# Altium project MotherBoard.PrjPCB
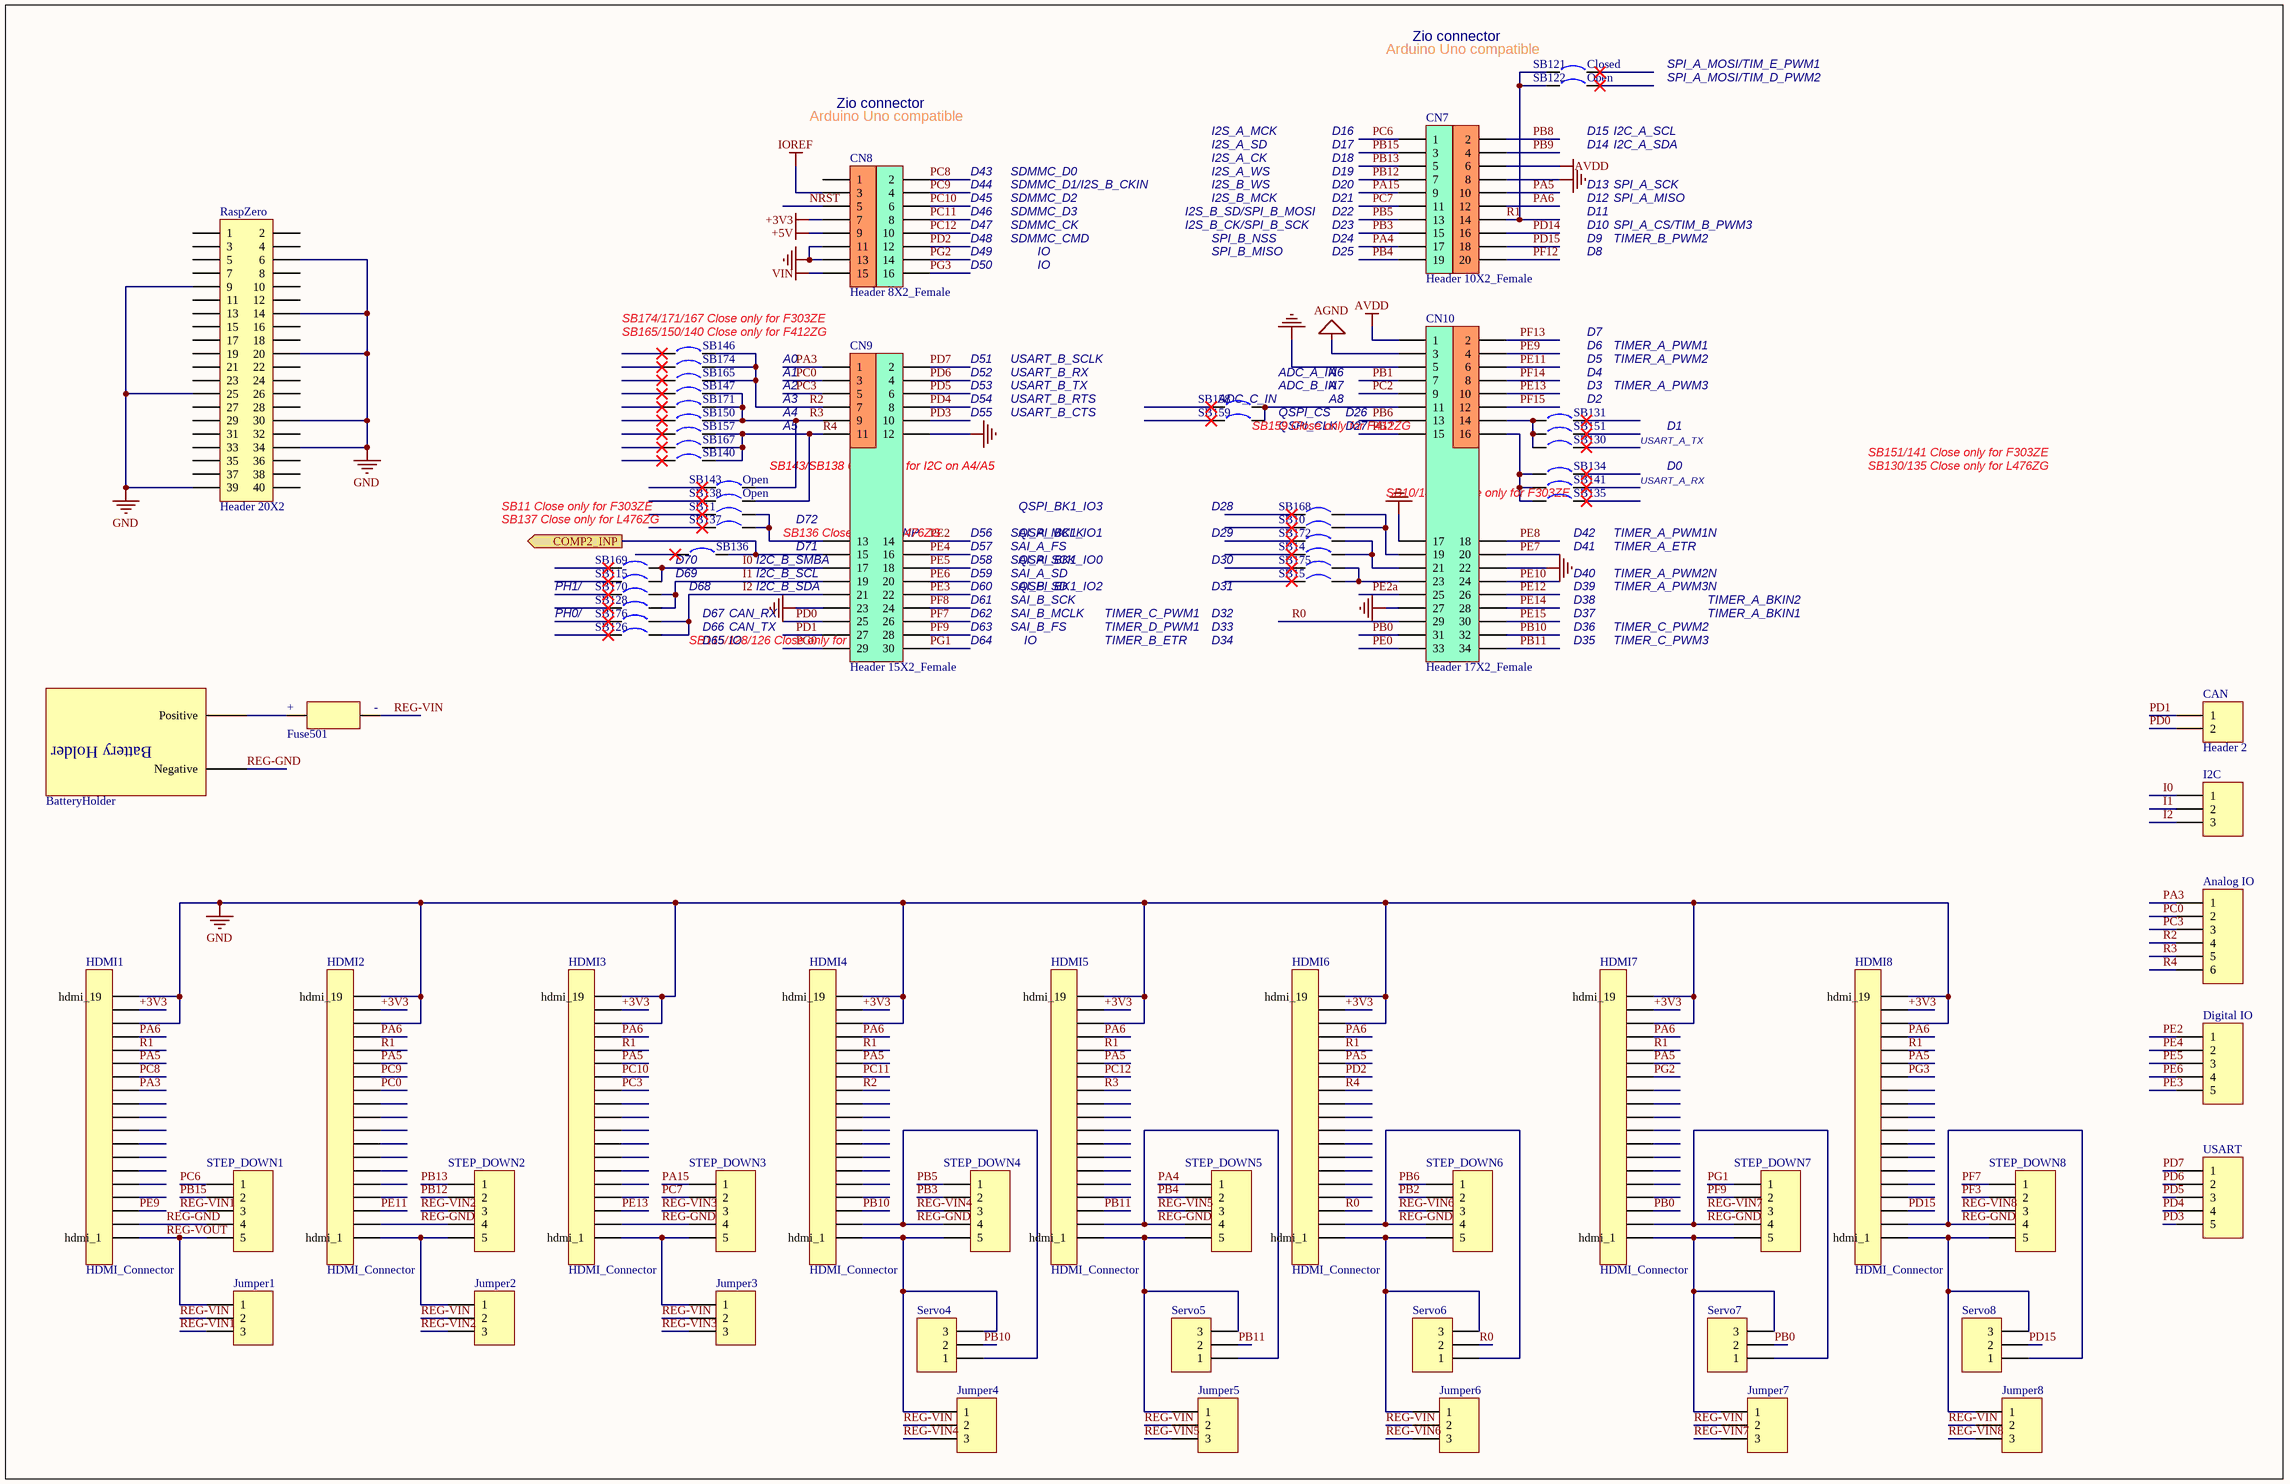
[diagram p0: MB1137.SchDoc]
2 sheets, 77 parts. Net scope: flat (ports and power ports of the same name join across sheets).
Board file: MB1137.PcbDoc
Sheets:
  MB1137.SchDoc
  Connectors.SchDoc

## Sheet MB1137.SchDoc: TOP & POWER
size Tabloid; DocumentNumber: MB1137; Revision: B-01; SheetNumber: 1; SheetTotal: 6; Project: NUCLEO-XXXXZX

### Parts
Analog_IO  Header 6  [HDR1X6]  (value not drawn)
BatteryHolder  BatteryHolder  [SOIC127P370X135-2N]  (value not drawn)
CAN  Header 2  [HDR1X2]
CN7  Header 10X2_Female  [HDR_10x2_2R54_V_F]
CN8  Header 8X2_Female  [HDR_8x2_2R54_V_F]
CN9  Header 15X2_Female  [HDR_15x2_2R54_V_F]
CN10  Header 17X2_Female  [HDR_17x2_2R54_V_F]
Digital_IO  Header 5  [HDR1X5]  (value not drawn)
Fuse501  Fuse501  (value not drawn)
HDMI1  HDMI_Connector  [HDMI-CONNECTOR]
HDMI2  HDMI_Connector  [HDMI-CONNECTOR]
HDMI3  HDMI_Connector  [HDMI-CONNECTOR]
HDMI4  HDMI_Connector  [HDMI-CONNECTOR]
HDMI5  HDMI_Connector  [HDMI-CONNECTOR]
HDMI6  HDMI_Connector  [HDMI-CONNECTOR]
HDMI7  HDMI_Connector  [HDMI-CONNECTOR]
HDMI8  HDMI_Connector  [HDMI-CONNECTOR]
I2C  Header 3  [HDR1X3]  (value not drawn)
Jumper1  Header 3  [HDR1X3]  (value not drawn)
Jumper2  Header 3  [HDR1X3]  (value not drawn)
Jumper3  Header 3  [HDR1X3]  (value not drawn)
Jumper4  Header 3  [HDR1X3]  (value not drawn)
Jumper5  Header 3  [HDR1X3]  (value not drawn)
Jumper6  Header 3  [HDR1X3]  (value not drawn)
Jumper7  Header 3  [HDR1X3]  (value not drawn)
Jumper8  Header 3  [HDR1X3]  (value not drawn)
RaspZero  Header 20X2  [HDR2X20]
SB10  Circuit Breaker  [SB_0603]  (value not drawn)
SB11  Circuit Breaker  [SB_0603]  (value not drawn)
SB14  Circuit Breaker  [SB_0603]  (value not drawn)
SB15  Circuit Breaker  [SB_0603]  (value not drawn)
SB115  Circuit Breaker  [SB_0603]  (value not drawn)
SB121  Closed  [SB_0603]
SB122  Open  [SB_0603]
SB126  Circuit Breaker  [SB_0603]  (value not drawn)
SB128  Circuit Breaker  [SB_0603]  (value not drawn)
SB130  Circuit Breaker  [SB_0603]  (value not drawn)
SB131  Circuit Breaker  [SB_0603]  (value not drawn)
SB134  Circuit Breaker  [SB_0603]  (value not drawn)
SB135  Circuit Breaker  [SB_0603]  (value not drawn)
SB136  Circuit Breaker  [SB_0603]  (value not drawn)
SB137  Circuit Breaker  [SB_0603]  (value not drawn)
SB138  Open  [SB_0603]
SB140  Circuit Breaker  [SB_0603]  (value not drawn)
SB141  Circuit Breaker  [SB_0603]  (value not drawn)
SB143  Open  [SB_0603]
SB146  Circuit Breaker  [SB_0603]  (value not drawn)
SB147  Circuit Breaker  [SB_0603]  (value not drawn)
SB150  Circuit Breaker  [SB_0603]  (value not drawn)
SB151  Circuit Breaker  [SB_0603]  (value not drawn)
SB157  Circuit Breaker  [SB_0603]  (value not drawn)
SB158  Circuit Breaker  [SB_0603]  (value not drawn)
SB159  Circuit Breaker  [SB_0603]  (value not drawn)
SB165  Circuit Breaker  [SB_0603]  (value not drawn)
SB167  Circuit Breaker  [SB_0603]  (value not drawn)
SB168  Circuit Breaker  [SB_0603]  (value not drawn)
SB169  Circuit Breaker  [SB_0603]  (value not drawn)
SB170  Circuit Breaker  [SB_0603]  (value not drawn)
SB171  Circuit Breaker  [SB_0603]  (value not drawn)
SB172  Circuit Breaker  [SB_0603]  (value not drawn)
SB174  Circuit Breaker  [SB_0603]  (value not drawn)
SB175  Circuit Breaker  [SB_0603]  (value not drawn)
SB176  Circuit Breaker  [SB_0603]  (value not drawn)
Servo4  Header 3  [HDR1X3]  (value not drawn)
Servo5  Header 3  [HDR1X3]  (value not drawn)
Servo6  Header 3  [HDR1X3]  (value not drawn)
Servo7  Header 3  [HDR1X3]  (value not drawn)
Servo8  Header 3  [HDR1X3]  (value not drawn)
STEP_DOWN1  Header 5  [HDR1X5]  (value not drawn)
STEP_DOWN2  Header 5  [HDR1X5]  (value not drawn)
STEP_DOWN3  Header 5  [HDR1X5]  (value not drawn)
STEP_DOWN4  Header 5  [HDR1X5]  (value not drawn)
STEP_DOWN5  Header 5  [HDR1X5]  (value not drawn)
STEP_DOWN6  Header 5  [HDR1X5]  (value not drawn)
STEP_DOWN7  Header 5  [HDR1X5]  (value not drawn)
STEP_DOWN8  Header 5  [HDR1X5]  (value not drawn)
USART  Header 5  [HDR1X5]  (value not drawn)

### Ports
COMP2_INP (out)

### Nets
+3V3: CN8.7 HDMI1.hdmi_18 HDMI2.hdmi_18 HDMI3.hdmi_18 HDMI4.hdmi_18 HDMI5.hdmi_18 HDMI6.hdmi_18 HDMI7.hdmi_18 HDMI8.hdmi_18
+5V: CN8.9
AGND: CN10.3
AVDD: CN7.6 CN10.1
GND: CN7.8 CN8.11 CN8.13 CN9.12 CN9.23 CN10.5 CN10.17 CN10.22 CN10.27 HDMI1.hdmi_17 HDMI1.hdmi_19 HDMI2.hdmi_17 HDMI2.hdmi_19 HDMI3.hdmi_17 HDMI3.hdmi_19 HDMI4.hdmi_17 HDMI4.hdmi_19 HDMI5.hdmi_17 HDMI5.hdmi_19 HDMI6.hdmi_17 HDMI6.hdmi_19 HDMI7.hdmi_17 HDMI7.hdmi_19 HDMI8.hdmi_17 HDMI8.hdmi_19 RaspZero.6 RaspZero.9 RaspZero.14 RaspZero.20 RaspZero.25 RaspZero.30 RaspZero.34 RaspZero.39
IOREF: CN8.3
VIN: CN8.15
I0: CN9.17 I2C.1 SB115.1 SB169.1
I1: CN9.19 I2C.2 SB128.1 SB170.1
I2: CN9.21 I2C.3 SB126.1 SB176.1
NRST: CN8.5
PA3: Analog_IO.1 CN9.1 HDMI1.hdmi_12
PA4: CN7.17 STEP_DOWN5.1
PA5: CN7.10 HDMI1.hdmi_14 HDMI2.hdmi_14 HDMI3.hdmi_14 HDMI4.hdmi_14 HDMI5.hdmi_14 HDMI6.hdmi_14 HDMI7.hdmi_14 HDMI8.hdmi_14
PA6: CN7.12 HDMI1.hdmi_16 HDMI2.hdmi_16 HDMI3.hdmi_16 HDMI4.hdmi_16 HDMI5.hdmi_16 HDMI6.hdmi_16 HDMI7.hdmi_16 HDMI8.hdmi_16
PA15: CN7.9 STEP_DOWN3.1
PB0: CN10.31 HDMI7.hdmi_3 Servo7.2
PB1: CN10.7
PB2: CN10.15 STEP_DOWN6.2
PB3: CN7.15 STEP_DOWN4.2
PB4: CN7.19 STEP_DOWN5.2
PB5: CN7.13 STEP_DOWN4.1
PB6: CN10.13 STEP_DOWN6.1
PB8: CN7.2
PB9: CN7.4
PB10: CN10.32 HDMI4.hdmi_3 Servo4.2
PB11: CN10.34 HDMI5.hdmi_3 Servo5.2
PB12: CN7.7 STEP_DOWN2.2
PB13: CN7.5 STEP_DOWN2.1
PB15: CN7.3 STEP_DOWN1.2
PC0: Analog_IO.2 CN9.3 HDMI2.hdmi_12
PC2: CN10.9
PC3: Analog_IO.3 CN9.5 HDMI3.hdmi_12
PC6: CN7.1 STEP_DOWN1.1
PC7: CN7.11 STEP_DOWN3.2
PC8: CN8.2 HDMI1.hdmi_13
PC9: CN8.4 HDMI2.hdmi_13
PC10: CN8.6 HDMI3.hdmi_13
PC11: CN8.8 HDMI4.hdmi_13
PC12: CN8.10 HDMI5.hdmi_13
PD0: CAN.2 CN9.25
PD1: CAN.1 CN9.27
PD2: CN8.12 HDMI6.hdmi_13
PD3: CN9.10 USART.5
PD4: CN9.8 USART.4
PD5: CN9.6 USART.3
PD6: CN9.4 USART.2
PD7: CN9.2 USART.1
PD14: CN7.16
PD15: CN7.18 HDMI8.hdmi_3 Servo8.2
PE0: CN10.33
PE2: CN9.14 Digital_IO.1
PE2a: CN10.25
PE3: CN9.22 Digital_IO.5
PE4: CN9.16 Digital_IO.2
PE5: CN9.18 Digital_IO.3
PE6: CN9.20 Digital_IO.4
PE7: CN10.20
PE8: CN10.18
PE9: CN10.4 HDMI1.hdmi_3
PE10: CN10.24
PE11: CN10.6 HDMI2.hdmi_3
PE12: CN10.26
PE13: CN10.10 HDMI3.hdmi_3
PE14: CN10.28
PE15: CN10.30
PF3: STEP_DOWN8.2
PF7: CN9.26 STEP_DOWN8.1
PF8: CN9.24
PF9: CN9.28 STEP_DOWN7.2
PF12: CN7.20
PF13: CN10.2
PF14: CN10.8
PF15: CN10.12
PG0: CN9.29
PG1: CN9.30 STEP_DOWN7.1
PG2: CN8.14 HDMI7.hdmi_13
PG3: CN8.16 HDMI8.hdmi_13
R0: CN10.29 HDMI6.hdmi_3 Servo6.2
R1: CN7.14 HDMI1.hdmi_15 HDMI2.hdmi_15 HDMI3.hdmi_15 HDMI4.hdmi_15 HDMI5.hdmi_15 HDMI6.hdmi_15 HDMI7.hdmi_15 HDMI8.hdmi_15 SB121.1 SB122.1
R2: Analog_IO.4 CN9.7 HDMI4.hdmi_12 SB146.1 SB165.1 SB174.1
R3: Analog_IO.5 CN9.9 HDMI5.hdmi_12 SB143.1 SB147.1 SB150.1 SB171.1
R4: Analog_IO.6 CN9.11 HDMI6.hdmi_12 SB138.1 SB140.1 SB157.1 SB167.1
REG-GND: BatteryHolder.1n(Negative) HDMI1.hdmi_2 HDMI2.hdmi_2 HDMI3.hdmi_2 HDMI4.hdmi_2 HDMI5.hdmi_2 HDMI6.hdmi_2 HDMI7.hdmi_2 HDMI8.hdmi_2 Servo4.1 Servo5.1 Servo6.1 Servo7.1 Servo8.1 STEP_DOWN1.4 STEP_DOWN2.4 STEP_DOWN3.4 STEP_DOWN4.4 STEP_DOWN5.4 STEP_DOWN6.4 STEP_DOWN7.4 STEP_DOWN8.4
REG-VIN: Fuse501.Fuse- Jumper1.2 Jumper2.2 Jumper3.2 Jumper4.2 Jumper5.2 Jumper6.2 Jumper7.2 Jumper8.2
REG-VIN1: Jumper1.3 STEP_DOWN1.3
REG-VIN2: Jumper2.3 STEP_DOWN2.3
REG-VIN3: Jumper3.3 STEP_DOWN3.3
REG-VIN4: Jumper4.3 STEP_DOWN4.3
REG-VIN5: Jumper5.3 STEP_DOWN5.3
REG-VIN6: Jumper6.3 STEP_DOWN6.3
REG-VIN7: Jumper7.3 STEP_DOWN7.3
REG-VIN8: Jumper8.3 STEP_DOWN8.3
REG-VOUT: HDMI1.hdmi_1 Jumper1.1 STEP_DOWN1.5
NetBatteryHolder_1p: BatteryHolder.1p(Positive) Fuse501.Fuse+
NetCN9_13: CN9.13 SB11.1 SB137.1
NetCN9_15: CN9.15 SB136.1 ; port COMP2_INP
NetCN10_11: CN10.11 SB158.2 SB159.2
NetCN10_14: CN10.14 SB130.2 SB131.2 SB151.2
NetCN10_16: CN10.16 SB134.2 SB135.2 SB141.2
NetCN10_19: CN10.19 SB10.2 SB168.2
NetCN10_21: CN10.21 SB14.2 SB172.2
NetCN10_23: CN10.23 SB15.2 SB175.2
NetHDMI2_hdmi_1: HDMI2.hdmi_1 Jumper2.1 STEP_DOWN2.5
NetHDMI3_hdmi_1: HDMI3.hdmi_1 Jumper3.1 STEP_DOWN3.5
NetHDMI4_hdmi_1: HDMI4.hdmi_1 Jumper4.1 Servo4.3 STEP_DOWN4.5
NetHDMI5_hdmi_1: HDMI5.hdmi_1 Jumper5.1 Servo5.3 STEP_DOWN5.5
NetHDMI6_hdmi_1: HDMI6.hdmi_1 Jumper6.1 Servo6.3 STEP_DOWN6.5
NetHDMI7_hdmi_1: HDMI7.hdmi_1 Jumper7.1 Servo7.3 STEP_DOWN7.5
NetHDMI8_hdmi_1: HDMI8.hdmi_1 Jumper8.1 Servo8.3 STEP_DOWN8.5

Not connected (* = marked no-connect by the designer): CN8 1; HDMI1 hdmi_4 hdmi_5 hdmi_6 hdmi_7 hdmi_8 hdmi_9 hdmi_10 hdmi_11; HDMI2 hdmi_4 hdmi_5 hdmi_6 hdmi_7 hdmi_8 hdmi_9 hdmi_10 hdmi_11; HDMI3 hdmi_4 hdmi_5 hdmi_6 hdmi_7 hdmi_8 hdmi_9 hdmi_10 hdmi_11; HDMI4 hdmi_4 hdmi_5 hdmi_6 hdmi_7 hdmi_8 hdmi_9 hdmi_10 hdmi_11; HDMI5 hdmi_4 hdmi_5 hdmi_6 hdmi_7 hdmi_8 hdmi_9 hdmi_10 hdmi_11; HDMI6 hdmi_4 hdmi_5 hdmi_6 hdmi_7 hdmi_8 hdmi_9 hdmi_10 hdmi_11; HDMI7 hdmi_4 hdmi_5 hdmi_6 hdmi_7 hdmi_8 hdmi_9 hdmi_10 hdmi_11 hdmi_12; HDMI8 hdmi_4 hdmi_5 hdmi_6 hdmi_7 hdmi_8 hdmi_9 hdmi_10 hdmi_11 hdmi_12; RaspZero 1 2 3 4 5 7 8 10 11 12 13 15 16 17 18 19 21 22 23 24 26 27 28 29 31 32 33 35 36 37 38 40; SB10 1*; SB11 2*; SB14 1*; SB15 1*; SB115 2*; SB121 2*; SB122 2*; SB126 2*; SB128 2*; SB130 1*; SB131 1*; SB134 1*; SB135 1*; SB136 2*; SB137 2*; SB138 2*; SB140 2*; SB141 1*; SB143 2*; SB146 2*; SB147 2*; SB150 2*; SB151 1*; SB157 2*; SB158 1*; SB159 1*; SB165 2*; SB167 2*; SB168 1*; SB169 2*; SB170 2*; SB171 2*; SB172 1*; SB174 2*; SB175 1*; SB176 2*

### Notes on the sheet
- Arduino Uno compatible
- Zio connector
- SPI_A_MOSI/TIM_E_PWM1
- SPI_A_MOSI/TIM_D_PWM2
- I2S_A_SD
- I2S_A_CK
- I2S_A_MCK
- D16
- D17
- D18
- D14
- D15
- I2C_A_SCL
- I2C_A_SDA
- D43
- D44
- D45
- D46
- D47
- SDMMC_CK
- SDMMC_D0
- SDMMC_D1/I2S_B_CKIN
- SDMMC_D2
- SDMMC_D3
- I2S_B_SD/SPI_B_MOSI
- I2S_B_CK/SPI_B_SCK
- I2S_A_WS
- I2S_B_WS
- I2S_B_MCK
- D19
- D20
- D21
- D22
- D23
- D10
- D13
- D12
- D11
- SPI_A_CS/TIM_B_PWM3
- SPI_A_SCK
- SPI_A_MISO
- D48
- D49
- D50
- SDMMC_CMD
- IO
- SPI_B_MISO
- SPI_B_NSS
- D24
- D25
- D8
- D9
- TIMER_B_PWM2
- SB174/171/167 Close only for F303ZE
- (near SB146) SB165/150/140 Close only for F412ZG
- A0
- D51
- USART_B_SCLK
- D5
- D6
- D7
- TIMER_A_PWM1
- TIMER_A_PWM2
- A1
- A2
- A3
- A4
- A5
- D52
- D53
- D54
- D55
- USART_B_TX
- USART_B_RX
- USART_B_CTS
- USART_B_RTS
- (near SB159) SB159 Close only for F412ZG
- QSPI_CLK
- QSPI_CS
- ADC_A_IN
- ADC_B_IN
- ADC_C_IN
- A6
- A7
- A8
- D26
- D27
- (near SB131) D2
- D4
- D3
- TIMER_A_PWM3
- D1
- (near SB140) SB143/SB138 Close only for I2C on A4/A5
- (near SB168) SB10/14/15 Close only for F303ZE
- USART_A_TX
- USART_A_RX
- D0
- SB151/141 Close only for F303ZE
- SB130/135 Close only for L476ZG
- SB11 Close only for F303ZE
- SB137 Close only for L476ZG
- (near SB136) D70
- I2C_B_SMBA
- (near SB137) SB136 Close only for L476ZG
- D72
- D71
- (near CN9) COMP1_INP
- D56
- D57
- D58
- SAI_A_SCK
- SAI_A_FS
- SAI_A_MCLK
- QSPI_BK1_IO0
- QSPI_BK1_IO1
- QSPI_BK1_IO3
- D28
- D29
- D30
- D41
- D42
- TIMER_A_PWM1N
- TIMER_A_ETR
- PH0/
- PH1/
- (near SB136) D69
- D68
- D67
- D66
- CAN_TX
- CAN_RX
- I2C_B_SCL
- I2C_B_SDA
- D59
- D60
- D61
- D62
- D63
- SAI_A_SD
- SAI_B_SD
- SAI_B_SCK
- SAI_B_FS
- SAI_B_MCLK
- TIMER_D_PWM1
- TIMER_C_PWM1
- QSPI_BK1_IO2
- D31
- D32
- D33
- D36
- D37
- D38
- D39
- D40
- TIMER_A_PWM2N
- TIMER_A_PWM3N
- TIMER_C_PWM2
- TIMER_A_BKIN1
- TIMER_A_BKIN2
- (near SB126) SB115/128/126 Close only for F303ZE
- D65
- D64
- TIMER_B_ETR
- D34
- D35
- TIMER_C_PWM3
- (in symbol BatteryHolder) Battery Holder
- (in symbol Fuse501) +; -

### Library data of the parts
Analog_IO = Header 6: Header, 6-Pin; LatestRevisionDate: 17-Jul-2002; LatestRevisionNote: Re-released for DXP Platform.; Publisher: Altium Limited
CAN = Header 2: Header, 2-Pin; LatestRevisionDate: 17-Jul-2002; LatestRevisionNote: Re-released for DXP Platform.; Publisher: Altium Limited
CN7 = Header 10X2_Female: Header, 10-Pin, Dual row,female; LatestRevisionDate: 17-Jul-2002; LatestRevisionNote: Re-released for DXP Platform.; Publisher: Altium Limited
CN8 = Header 8X2_Female: Header, 8-Pin, Dual row,female; LatestRevisionDate: 17-Jul-2002; LatestRevisionNote: Re-released for DXP Platform.; Publisher: Altium Limited
CN9 = Header 15X2_Female: Header, 15-Pin, Dual row,female; Revision: 17-Jul-2002: Re-released for DXP Platform.; Publisher: Altium Limited
CN10 = Header 17X2_Female: Header, 17-Pin, Dual row,female; Revision: 17-Jul-2002: Re-released for DXP Platform.; Publisher: Altium Limited
Digital_IO STEP_DOWN1-STEP_DOWN8 USART = Header 5: Header, 5-Pin; LatestRevisionDate: 17-Jul-2002; LatestRevisionNote: Re-released for DXP Platform.; Publisher: Altium Limited
I2C Jumper1-Jumper8 Servo4-Servo8 = Header 3: Header, 3-Pin; LatestRevisionDate: 17-Jul-2002; LatestRevisionNote: Re-released for DXP Platform.; Publisher: Altium Limited
RaspZero = Header 20X2: Header, 20-Pin, Dual row; LatestRevisionDate: 17-Jul-2002; LatestRevisionNote: Re-released for DXP Platform.; Publisher: Altium Limited
SB10 SB11 SB14 SB15 SB115 SB126 SB128 SB130 SB131 SB134-SB137 SB140 SB141 SB146 SB147 SB150 SB151 SB157-SB159 SB165 SB167-SB172 SB174-SB176 = Circuit Breaker: Solder: NO; Published: 24-Mar-1999; Revision: July-2002: Re-released for DXP Platform.; Publisher: Altium Limited
SB121 = Circuit Breaker_close: Circuit Breaker; Published: 24-Mar-1999; Revision: July-2002: Re-released for DXP Platform.; Publisher: Altium Limited
SB122 SB138 SB143 = Circuit Breaker: Published: 24-Mar-1999; Revision: July-2002: Re-released for DXP Platform.; Publisher: Altium Limited

## Sheet Connectors.SchDoc: Extension connectors
size A3; DocumentNumber: MB1137; Revision: B-01; SheetNumber: 6; SheetTotal: 6; Project: NUCLEO-XXXXZX
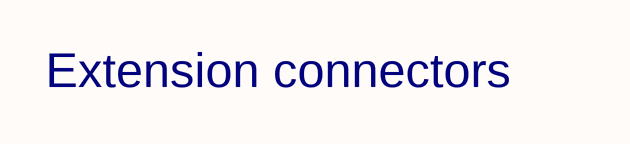
[diagram p1: Connectors.SchDoc]

### Notes on the sheet
- Extension connectors
- Title:
- Project:
- Size:
- Date:
- A3
- Reference:
- Sheet:
- Revision:
- of